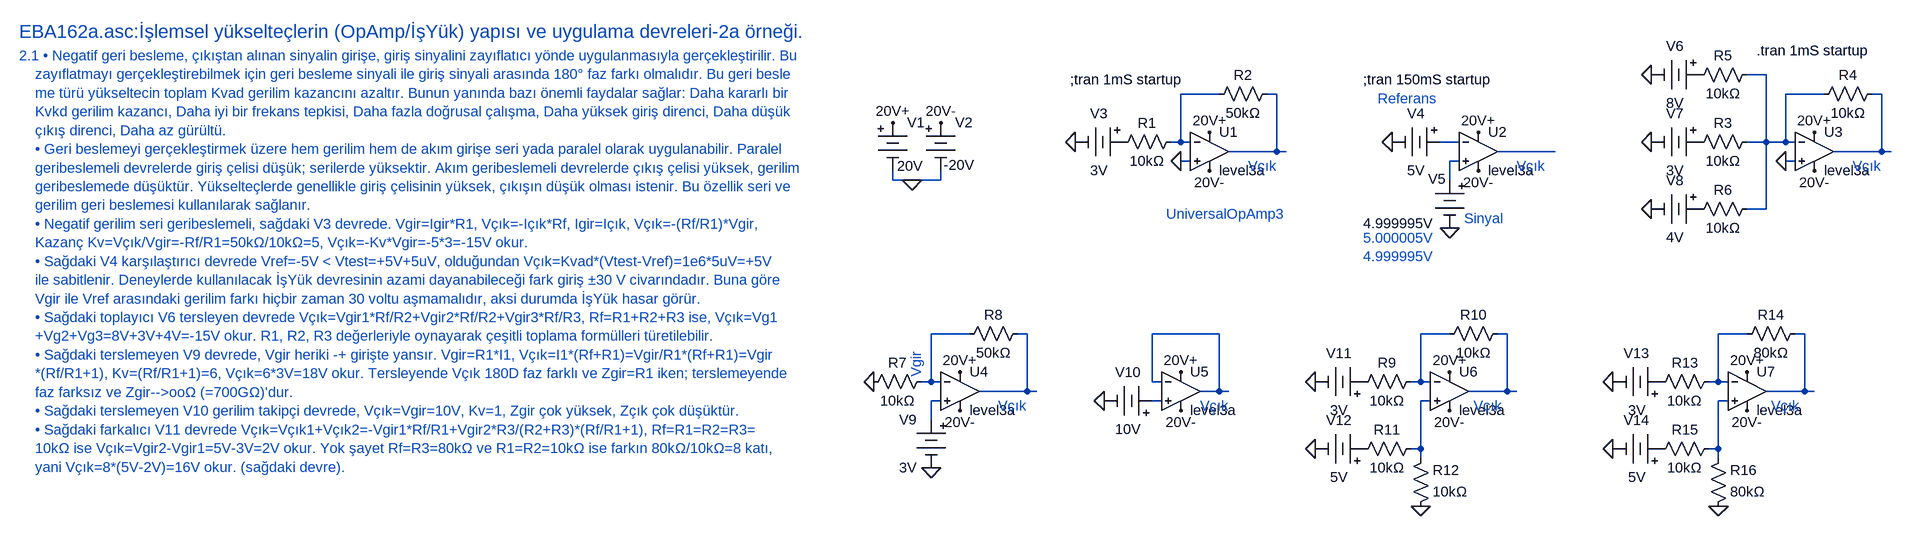
[diagram p0: schematic EBA162a.asc]
EBA162a.asc, the LTspice schematic file:
Version 4
SHEET 1 6044 4332
WIRE 3040 128 3008 128
WIRE 2128 160 2064 160
WIRE 2224 160 2208 160
WIRE 3136 160 3072 160
WIRE 3232 160 3216 160
WIRE 2064 240 2064 160
WIRE 2064 240 2048 240
WIRE 2080 240 2064 240
WIRE 2528 240 2496 240
WIRE 3040 240 3040 128
WIRE 3040 240 3008 240
WIRE 3072 240 3072 160
WIRE 3072 240 3040 240
WIRE 3088 240 3072 240
WIRE 2224 256 2224 160
WIRE 2224 256 2144 256
WIRE 2240 256 2224 256
WIRE 2688 256 2592 256
WIRE 3232 256 3232 160
WIRE 3232 256 3152 256
WIRE 3248 256 3232 256
WIRE 2080 272 2064 272
WIRE 2528 272 2512 272
WIRE 3088 272 3072 272
WIRE 1584 304 1584 288
WIRE 1616 304 1584 304
WIRE 1664 304 1664 288
WIRE 1664 304 1616 304
WIRE 2512 304 2512 272
WIRE 3040 352 3040 240
WIRE 3040 352 3008 352
WIRE 1712 560 1648 560
WIRE 1808 560 1792 560
WIRE 2128 560 2016 560
WIRE 2512 560 2464 560
WIRE 2608 560 2592 560
WIRE 3008 560 2960 560
WIRE 3104 560 3088 560
WIRE 1648 640 1648 560
WIRE 1648 640 1632 640
WIRE 1664 640 1648 640
WIRE 2016 640 2016 560
WIRE 2032 640 2016 640
WIRE 2464 640 2464 560
WIRE 2464 640 2448 640
WIRE 2480 640 2464 640
WIRE 2960 640 2960 560
WIRE 2960 640 2944 640
WIRE 2976 640 2960 640
WIRE 1808 656 1808 560
WIRE 1808 656 1728 656
WIRE 1824 656 1808 656
WIRE 2128 656 2128 560
WIRE 2128 656 2096 656
WIRE 2144 656 2128 656
WIRE 2608 656 2608 560
WIRE 2608 656 2544 656
WIRE 2624 656 2608 656
WIRE 3104 656 3104 560
WIRE 3104 656 3040 656
WIRE 3120 656 3104 656
WIRE 1664 672 1648 672
WIRE 2032 672 2016 672
WIRE 2480 672 2464 672
WIRE 2976 672 2960 672
WIRE 1648 704 1648 672
WIRE 2464 752 2464 672
WIRE 2464 752 2448 752
WIRE 2960 752 2960 672
WIRE 2960 752 2944 752
WIRE 2464 768 2464 752
WIRE 2960 768 2960 752
FLAG 1584 208 20V+
FLAG 1664 208 20V-
FLAG 1616 304 0
FLAG 2112 224 20V+
FLAG 1888 240 0
FLAG 2064 272 0
FLAG 2112 288 20V-
FLAG 2560 224 20V+
FLAG 2416 240 0
FLAG 2560 288 20V-
FLAG 2512 384 0
FLAG 3120 224 20V+
FLAG 2848 240 0
FLAG 3072 272 0
FLAG 3120 288 20V-
FLAG 2848 128 0
FLAG 2848 352 0
FLAG 1696 624 20V+
FLAG 1552 640 0
FLAG 1696 688 20V-
FLAG 1648 784 0
FLAG 2064 624 20V+
FLAG 2064 688 20V-
FLAG 1936 672 0
FLAG 2512 624 20V+
FLAG 2288 752 0
FLAG 2512 688 20V-
FLAG 2464 848 0
FLAG 2288 640 0
FLAG 3008 624 20V+
FLAG 2784 752 0
FLAG 3008 688 20V-
FLAG 2960 848 0
FLAG 2784 640 0
SYMBOL Misc\\battery 1584 192 R0
WINDOW 3 7 88 Left 2
SYMATTR Value 20V
SYMATTR InstName V1
SYMBOL Misc\\battery 1664 192 R0
WINDOW 3 5 87 Left 2
SYMATTR Value -20V
SYMATTR InstName V2
SYMBOL Misc\\battery 1984 240 R90
WINDOW 3 32 56 VTop 2
WINDOW 0 -32 56 VBottom 2
SYMATTR Value 3V
SYMATTR InstName V3
SYMBOL res 2064 224 R90
WINDOW 0 0 56 VBottom 2
WINDOW 3 32 56 VTop 2
SYMATTR InstName R1
SYMATTR Value 10kΩ
SYMBOL OpAmps\\UniversalOpAmp3 2112 256 R0
SYMATTR InstName U1
SYMBOL res 2224 144 R90
WINDOW 0 0 56 VBottom 2
WINDOW 3 32 56 VTop 2
SYMATTR InstName R2
SYMATTR Value 50kΩ
SYMBOL Misc\\battery 2512 240 R90
WINDOW 3 32 56 VTop 2
WINDOW 0 -32 56 VBottom 2
SYMATTR Value 5V
SYMATTR InstName V4
SYMBOL OpAmps\\UniversalOpAmp3 2560 256 R0
SYMATTR InstName U2
SYMBOL Misc\\battery 2512 288 M0
WINDOW 3 27 88 Left 2
WINDOW 0 6 14 Left 2
SYMATTR Value 4.999995V
SYMATTR InstName V5
SYMBOL Misc\\battery 2944 240 R90
WINDOW 3 32 56 VTop 2
WINDOW 0 -32 56 VBottom 2
SYMATTR Value 3V
SYMATTR InstName V7
SYMBOL res 3024 224 R90
WINDOW 0 0 56 VBottom 2
WINDOW 3 32 56 VTop 2
SYMATTR InstName R3
SYMATTR Value 10kΩ
SYMBOL OpAmps\\UniversalOpAmp3 3120 256 R0
SYMATTR InstName U3
SYMBOL res 3232 144 R90
WINDOW 0 0 56 VBottom 2
WINDOW 3 32 56 VTop 2
SYMATTR InstName R4
SYMATTR Value 10kΩ
SYMBOL Misc\\battery 2944 128 R90
WINDOW 3 32 56 VTop 2
WINDOW 0 -32 56 VBottom 2
SYMATTR Value 8V
SYMATTR InstName V6
SYMBOL res 3024 112 R90
WINDOW 0 0 56 VBottom 2
WINDOW 3 32 56 VTop 2
SYMATTR InstName R5
SYMATTR Value 10kΩ
SYMBOL Misc\\battery 2944 352 R90
WINDOW 3 32 56 VTop 2
WINDOW 0 -32 56 VBottom 2
SYMATTR Value 4V
SYMATTR InstName V8
SYMBOL res 3024 336 R90
WINDOW 0 0 56 VBottom 2
WINDOW 3 32 56 VTop 2
SYMATTR InstName R6
SYMATTR Value 10kΩ
SYMBOL Misc\\battery 1648 688 M0
SYMATTR Value 3V
SYMATTR InstName V9
SYMBOL res 1648 624 R90
WINDOW 0 0 56 VBottom 2
WINDOW 3 32 56 VTop 2
SYMATTR InstName R7
SYMATTR Value 10kΩ
SYMBOL OpAmps\\UniversalOpAmp3 1696 656 R0
SYMATTR InstName U4
SYMBOL res 1808 544 R90
WINDOW 0 0 56 VBottom 2
WINDOW 3 32 56 VTop 2
SYMATTR InstName R8
SYMATTR Value 50kΩ
SYMBOL Misc\\battery 2032 672 M270
WINDOW 3 -32 56 VBottom 2
WINDOW 0 32 56 VTop 2
SYMATTR Value 10V
SYMATTR InstName V10
SYMBOL OpAmps\\UniversalOpAmp3 2064 656 R0
SYMATTR InstName U5
SYMBOL Misc\\battery 2384 752 M270
WINDOW 3 -32 56 VBottom 2
WINDOW 0 32 56 VTop 2
SYMATTR Value 5V
SYMATTR InstName V12
SYMBOL res 2464 624 R90
WINDOW 0 0 56 VBottom 2
WINDOW 3 32 56 VTop 2
SYMATTR InstName R9
SYMATTR Value 10kΩ
SYMBOL OpAmps\\UniversalOpAmp3 2512 656 R0
SYMATTR InstName U6
SYMBOL res 2608 544 R90
WINDOW 0 0 56 VBottom 2
WINDOW 3 32 56 VTop 2
SYMATTR InstName R10
SYMATTR Value 10kΩ
SYMBOL Misc\\battery 2384 640 M270
WINDOW 3 -32 56 VBottom 2
WINDOW 0 32 56 VTop 2
SYMATTR Value 3V
SYMATTR InstName V11
SYMBOL res 2464 736 R90
WINDOW 0 0 56 VBottom 2
WINDOW 3 32 56 VTop 2
SYMATTR InstName R11
SYMATTR Value 10kΩ
SYMBOL res 2448 864 M180
WINDOW 0 36 76 Left 2
WINDOW 3 36 40 Left 2
SYMATTR InstName R12
SYMATTR Value 10kΩ
SYMBOL Misc\\battery 2880 752 M270
WINDOW 3 -32 56 VBottom 2
WINDOW 0 32 56 VTop 2
SYMATTR Value 5V
SYMATTR InstName V14
SYMBOL res 2960 624 R90
WINDOW 0 0 56 VBottom 2
WINDOW 3 32 56 VTop 2
SYMATTR InstName R13
SYMATTR Value 10kΩ
SYMBOL OpAmps\\UniversalOpAmp3 3008 656 R0
SYMATTR InstName U7
SYMBOL res 3104 544 R90
WINDOW 0 0 56 VBottom 2
WINDOW 3 32 56 VTop 2
SYMATTR InstName R14
SYMATTR Value 80kΩ
SYMBOL Misc\\battery 2880 640 M270
WINDOW 3 -32 56 VBottom 2
WINDOW 0 32 56 VTop 2
SYMATTR Value 3V
SYMATTR InstName V13
SYMBOL res 2960 736 R90
WINDOW 0 0 56 VBottom 2
WINDOW 3 32 56 VTop 2
SYMATTR InstName R15
SYMATTR Value 10kΩ
SYMBOL res 2944 864 M180
WINDOW 0 36 76 Left 2
WINDOW 3 36 40 Left 2
SYMATTR InstName R16
SYMATTR Value 80kΩ
TEXT -232 56 Left 3 ;EBA162a.asc:İşlemsel yükselteçlerin (OpAmp/İşYük) yapısı ve uygulama devreleri-2a örneği.
TEXT -232 96 Left 2 ;2.1 • Negatif geri besleme, çıkıştan alınan sinyalin girişe, giriş sinyalini zayıflatıcı yönde uygulanmasıyla gerçekleştirilir. Bu \n    zayıflatmayı gerçekleştirebilmek için geri besleme sinyali ile giriş sinyali arasında 180° faz farkı olmalıdır. Bu geri besle\n    me türü yükseltecin toplam Kvad gerilim kazancını azaltır. Bunun yanında bazı önemli faydalar sağlar: Daha kararlı bir \n    Kvkd gerilim kazancı, Daha iyi bir frekans tepkisi, Daha fazla doğrusal çalışma, Daha yüksek giriş direnci, Daha düşük \n    çıkış direnci, Daha az gürültü.\n    • Geri beslemeyi gerçekleştirmek üzere hem gerilim hem de akım girişe seri yada paralel olarak uygulanabilir. Paralel \n    geribeslemeli devrelerde giriş çelisi düşük; serilerde yüksektir. Akım geribeslemeli devrelerde çıkış çelisi yüksek, gerilim \n    geribeslemede düşüktür. Yükselteçlerde genellikle giriş çelisinin yüksek, çıkışın düşük olması istenir. Bu özellik seri ve \n    gerilim geri beslemesi kullanılarak sağlanır.\n    • Negatif gerilim seri geribeslemeli, sağdaki V3 devrede. Vgir=Igir*R1, Vçık=-Içık*Rf, Igir=Içık, Vçık=-(Rf/R1)*Vgir,\n    Kazanç Kv=Vçık/Vgir=-Rf/R1=50kΩ/10kΩ=5, Vçık=-Kv*Vgir=-5*3=-15V okur.\n    • Sağdaki V4 karşılaştırıcı devrede Vref=-5V < Vtest=+5V+5uV, olduğundan Vçık=Kvad*(Vtest-Vref)=1e6*5uV=+5V\n    ile sabitlenir. Deneylerde kullanılacak İşYük devresinin azami dayanabileceği fark giriş ±30 V civarındadır. Buna göre \n    Vgir ile Vref arasındaki gerilim farkı hiçbir zaman 30 voltu aşmamalıdır, aksi durumda İşYük hasar görür.\n    • Sağdaki toplayıcı V6 tersleyen devrede Vçık=Vgir1*Rf/R2+Vgir2*Rf/R2+Vgir3*Rf/R3, Rf=R1+R2+R3 ise, Vçık=Vg1\n    +Vg2+Vg3=8V+3V+4V=-15V okur. R1, R2, R3 değerleriyle oynayarak çeşitli toplama formülleri türetilebilir.\n    • Sağdaki terslemeyen V9 devrede, Vgir heriki -+ girişte yansır. Vgir=R1*I1, Vçık=I1*(Rf+R1)=Vgir/R1*(Rf+R1)=Vgir\n    *(Rf/R1+1), Kv=(Rf/R1+1)=6, Vçık=6*3V=18V okur. Tersleyende Vçık 180D faz farklı ve Zgir=R1 iken; terslemeyende \n    faz farksız ve Zgir-->ooΩ (=700GΩ)'dur.\n    • Sağdaki terslemeyen V10 gerilim takipçi devrede, Vçık=Vgir=10V, Kv=1, Zgir çok yüksek, Zçık çok düşüktür.\n    • Sağdaki farkalıcı V11 devrede Vçık=Vçık1+Vçık2=-Vgir1*Rf/R1+Vgir2*R3/(R2+R3)*(Rf/R1+1), Rf=R1=R2=R3=\n    10kΩ ise Vçık=Vgir2-Vgir1=5V-3V=2V okur. Yok şayet Rf=R3=80kΩ ve R1=R2=10kΩ ise farkın 80kΩ/10kΩ=8 katı,\n    yani Vçık=8*(5V-2V)=16V okur. (sağdaki devre).
TEXT 2176 280 Left 2 ;Vçık
TEXT 2040 360 Left 2 ;UniversalOpAmp3
TEXT 1880 136 Left 2 !;tran 1mS startup
TEXT 2624 280 Left 2 ;Vçık
TEXT 2368 136 Left 2 !;tran 150mS startup
TEXT 2392 168 Left 2 ;Referans
TEXT 2536 368 Left 2 ;Sinyal
TEXT 2368 400 Left 2 ;5.000005V\n4.999995V
TEXT 3184 280 Left 2 ;Vçık
TEXT 3024 88 Left 2 !.tran 1mS startup
TEXT 1760 680 Left 2 ;Vçık
TEXT 1624 632 VLeft 2 ;Vgir
TEXT 2096 680 Left 2 ;Vçık
TEXT 2552 680 Left 2 ;Vçık
TEXT 3048 680 Left 2 ;Vçık

The netlist it stands for:
* EBA162a.asc
V1 20V+ 0 20V
V2 20V- 0 -20V
V3 P001 0 3V
R1 N002 P001 10kΩ
XU1 0 N002 20V+ 20V- N003 level3a  ; pins In+ In- V+ V- OUT
R2 N003 N002 50kΩ
V4 N005 0 5V
XU2 N007 N005 20V+ 20V- N006 level3a  ; pins In+ In- V+ V- OUT
V5 N007 0 4.999995V
V7 P002 0 3V
R3 N001 P002 10kΩ
XU3 0 N001 20V+ 20V- N004 level3a  ; pins In+ In- V+ V- OUT
R4 N004 N001 10kΩ
V6 P003 0 8V
R5 N001 P003 10kΩ
V8 P004 0 4V
R6 N001 P004 10kΩ
V9 N015 0 3V
R7 N008 0 10kΩ
XU4 N015 N008 20V+ 20V- N009 level3a  ; pins In+ In- V+ V- OUT
R8 N009 N008 50kΩ
V10 N016 0 10V
XU5 N016 N010 20V+ 20V- N010 level3a  ; pins In+ In- V+ V- OUT
V12 P005 0 5V
R9 N011 P006 10kΩ
XU6 N017 N011 20V+ 20V- N012 level3a  ; pins In+ In- V+ V- OUT
R10 N012 N011 10kΩ
V11 P006 0 3V
R11 N017 P005 10kΩ
R12 0 N017 10kΩ
V14 P007 0 5V
R13 N013 P008 10kΩ
XU7 N018 N013 20V+ 20V- N014 level3a  ; pins In+ In- V+ V- OUT
R14 N014 N013 80kΩ
V13 P008 0 3V
R15 N018 P007 10kΩ
R16 0 N018 80kΩ
* EBA162a.asc:İşlemsel yükselteçlerin (OpAmp/İşYük) yapısı ve uygulama devreleri-2a örneği.
* 2.1 • Negatif geri besleme, çıkıştan alınan sinyalin girişe, giriş sinyalini zayıflatıcı yönde uygulanmasıyla gerçekleştirilir. Bu
*     zayıflatmayı gerçekleştirebilmek için geri besleme sinyali ile giriş sinyali arasında 180° faz farkı olmalıdır. Bu geri besle
*     me türü yükseltecin toplam Kvad gerilim kazancını azaltır. Bunun yanında bazı önemli faydalar sağlar: Daha kararlı bir
*     Kvkd gerilim kazancı, Daha iyi bir frekans tepkisi, Daha fazla doğrusal çalışma, Daha yüksek giriş direnci, Daha düşük
*     çıkış direnci, Daha az gürültü.
*     • Geri beslemeyi gerçekleştirmek üzere hem gerilim hem de akım girişe seri yada paralel olarak uygulanabilir. Paralel
*     geribeslemeli devrelerde giriş çelisi düşük; serilerde yüksektir. Akım geribeslemeli devrelerde çıkış çelisi yüksek, gerilim
*     geribeslemede düşüktür. Yükselteçlerde genellikle giriş çelisinin yüksek, çıkışın düşük olması istenir. Bu özellik seri ve
*     gerilim geri beslemesi kullanılarak sağlanır.
*     • Negatif gerilim seri geribeslemeli, sağdaki V3 devrede. Vgir=Igir*R1, Vçık=-Içık*Rf, Igir=Içık, Vçık=-(Rf/R1)*Vgir,
*     Kazanç Kv=Vçık/Vgir=-Rf/R1=50kΩ/10kΩ=5, Vçık=-Kv*Vgir=-5*3=-15V okur.
*     • Sağdaki V4 karşılaştırıcı devrede Vref=-5V < Vtest=+5V+5uV, olduğundan Vçık=Kvad*(Vtest-Vref)=1e6*5uV=+5V
*     ile sabitlenir. Deneylerde kullanılacak İşYük devresinin azami dayanabileceği fark giriş ±30 V civarındadır. Buna göre
*     Vgir ile Vref arasındaki gerilim farkı hiçbir zaman 30 voltu aşmamalıdır, aksi durumda İşYük hasar görür.
*     • Sağdaki toplayıcı V6 tersleyen devrede Vçık=Vgir1*Rf/R2+Vgir2*Rf/R2+Vgir3*Rf/R3, Rf=R1+R2+R3 ise, Vçık=Vg1
*     +Vg2+Vg3=8V+3V+4V=-15V okur. R1, R2, R3 değerleriyle oynayarak çeşitli toplama formülleri türetilebilir.
*     • Sağdaki terslemeyen V9 devrede, Vgir heriki -+ girişte yansır. Vgir=R1*I1, Vçık=I1*(Rf+R1)=Vgir/R1*(Rf+R1)=Vgir
*     *(Rf/R1+1), Kv=(Rf/R1+1)=6, Vçık=6*3V=18V okur. Tersleyende Vçık 180D faz farklı ve Zgir=R1 iken; terslemeyende
*     faz farksız ve Zgir-->ooΩ (=700GΩ)'dur.
*     • Sağdaki terslemeyen V10 gerilim takipçi devrede, Vçık=Vgir=10V, Kv=1, Zgir çok yüksek, Zçık çok düşüktür.
*     • Sağdaki farkalıcı V11 devrede Vçık=Vçık1+Vçık2=-Vgir1*Rf/R1+Vgir2*R3/(R2+R3)*(Rf/R1+1), Rf=R1=R2=R3=
*     10kΩ ise Vçık=Vgir2-Vgir1=5V-3V=2V okur. Yok şayet Rf=R3=80kΩ ve R1=R2=10kΩ ise farkın 80kΩ/10kΩ=8 katı,
*     yani Vçık=8*(5V-2V)=16V okur. (sağdaki devre).
* Vçık
* UniversalOpAmp3
;tran 1mS startup
* Vçık
;tran 150mS startup
* Referans
* Sinyal
* 5.000005V
* 4.999995V
* Vçık
.tran 1mS startup
* Vçık
* Vgir
* Vçık
* Vçık
* Vçık
.backanno
.end